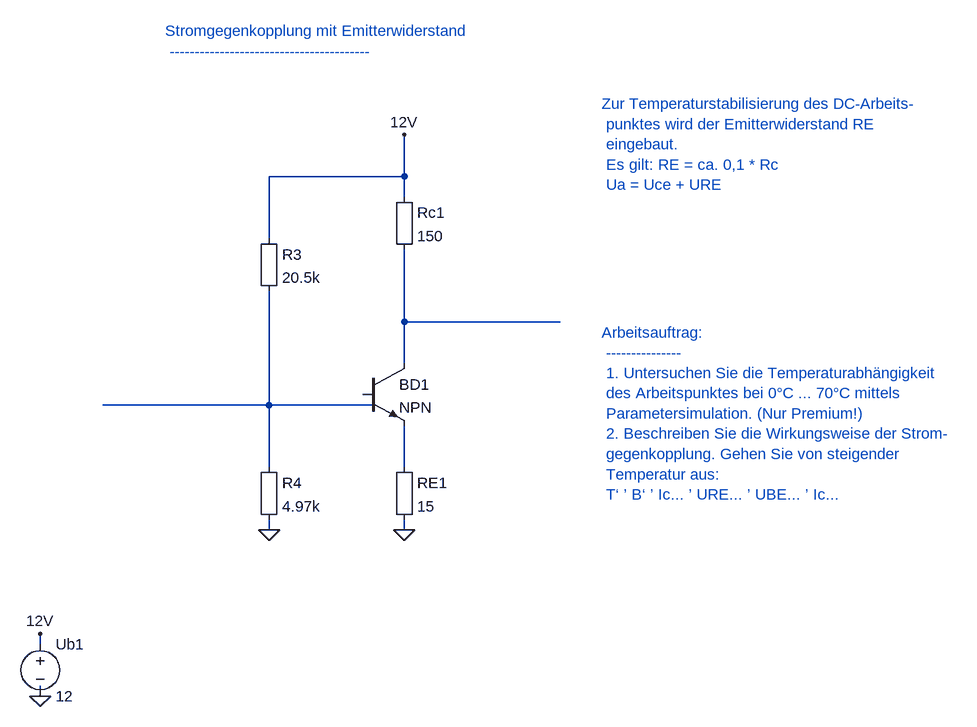
[diagram p0: schematic 9_1_3_2_Emitterwiderstand.asc]
9_1_3_2_Emitterwiderstand.asc, the LTspice schematic file:
Version 4
SHEET 1 880 680
WIRE 48 1072 48 1056
WIRE 544 608 560 608
WIRE 560 608 560 624
WIRE 608 656 608 688
WIRE 48 992 48 976
WIRE 608 688 608 720
WIRE 608 304 608 272
WIRE 608 384 608 496
WIRE 608 272 608 208
WIRE 400 368 400 272
WIRE 400 272 608 272
WIRE 400 624 560 624
WIRE 400 448 400 624
WIRE 400 720 400 624
WIRE 400 816 400 800
WIRE 608 496 608 560
WIRE 848 496 608 496
WIRE 144 624 400 624
WIRE 608 800 608 816
FLAG 608 816 0
FLAG 48 1072 0
FLAG 400 816 0
FLAG 608 816 0
FLAG 48 1072 0
FLAG 400 816 0
FLAG 608 208 12V
FLAG 48 976 12V
SYMBOL voltage 48 976 R0
SYMATTR InstName Ub1
SYMATTR Value 12
SYMBOL npn 544 560 R0
SYMATTR InstName BD1
SYMATTR Value NPN
SYMBOL Misc\EuropeanResistor 384 352 R0
SYMATTR InstName R3
SYMATTR Value 20.5k
SYMBOL Misc\EuropeanResistor 592 288 R0
SYMATTR InstName Rc1
SYMATTR Value 150
SYMBOL Misc\EuropeanResistor 384 704 R0
SYMATTR InstName R4
SYMATTR Value 4.97k
SYMBOL Misc\EuropeanResistor 592 704 R0
SYMATTR InstName RE1
SYMATTR Value 15
TEXT 240 48 Left 2 ;Stromgegenkopplung mit Emitterwiderstand \n ----------------------------------------
TEXT 912 512 Left 2 ;Arbeitsauftrag: \n --------------- \n 1. Untersuchen Sie die Temperaturabhängigkeit \n des Arbeitspunktes bei 0°C ... 70°C mittels \n Parametersimulation. (Nur Premium!) \n 2. Beschreiben Sie die Wirkungsweise der Strom- \n gegenkopplung. Gehen Sie von steigender \n Temperatur aus: \n T‘ ’ B‘ ’ Ic... ’ URE... ’ UBE... ’ Ic...
TEXT 912 160 Left 2 ;Zur Temperaturstabilisierung des DC-Arbeits- \n punktes wird der Emitterwiderstand RE \n eingebaut. \n Es gilt: RE = ca. 0,1 * Rc \n Ua = Uce + URE

The netlist it stands for:
* 9_1_3_2_Emitterwiderstand.asc
V§Ub1 12V 0 12
Q§BD1 N003 N001 N002 0 NPN
R3 12V N001 20.5k
Rc1 12V N003 150
R4 N001 0 4.97k
RE1 N002 0 15
.model NPN NPN
.model PNP PNP
.lib standard.bjt
* Stromgegenkopplung mit Emitterwiderstand
*  ----------------------------------------
* Arbeitsauftrag:
*  ---------------
*  1. Untersuchen Sie die Temperaturabhängigkeit
*  des Arbeitspunktes bei 0°C ... 70°C mittels
*  Parametersimulation. (Nur Premium!)
*  2. Beschreiben Sie die Wirkungsweise der Strom-
*  gegenkopplung. Gehen Sie von steigender
*  Temperatur aus:
*  T‘ ’ B‘ ’ Ic... ’ URE... ’ UBE... ’ Ic...
* Zur Temperaturstabilisierung des DC-Arbeits-
*  punktes wird der Emitterwiderstand RE
*  eingebaut.
*  Es gilt: RE = ca. 0,1 * Rc
*  Ua = Uce + URE
.backanno
.end